# EAGLE design PrismTricoreVCO (EAGLE 9.6.2)
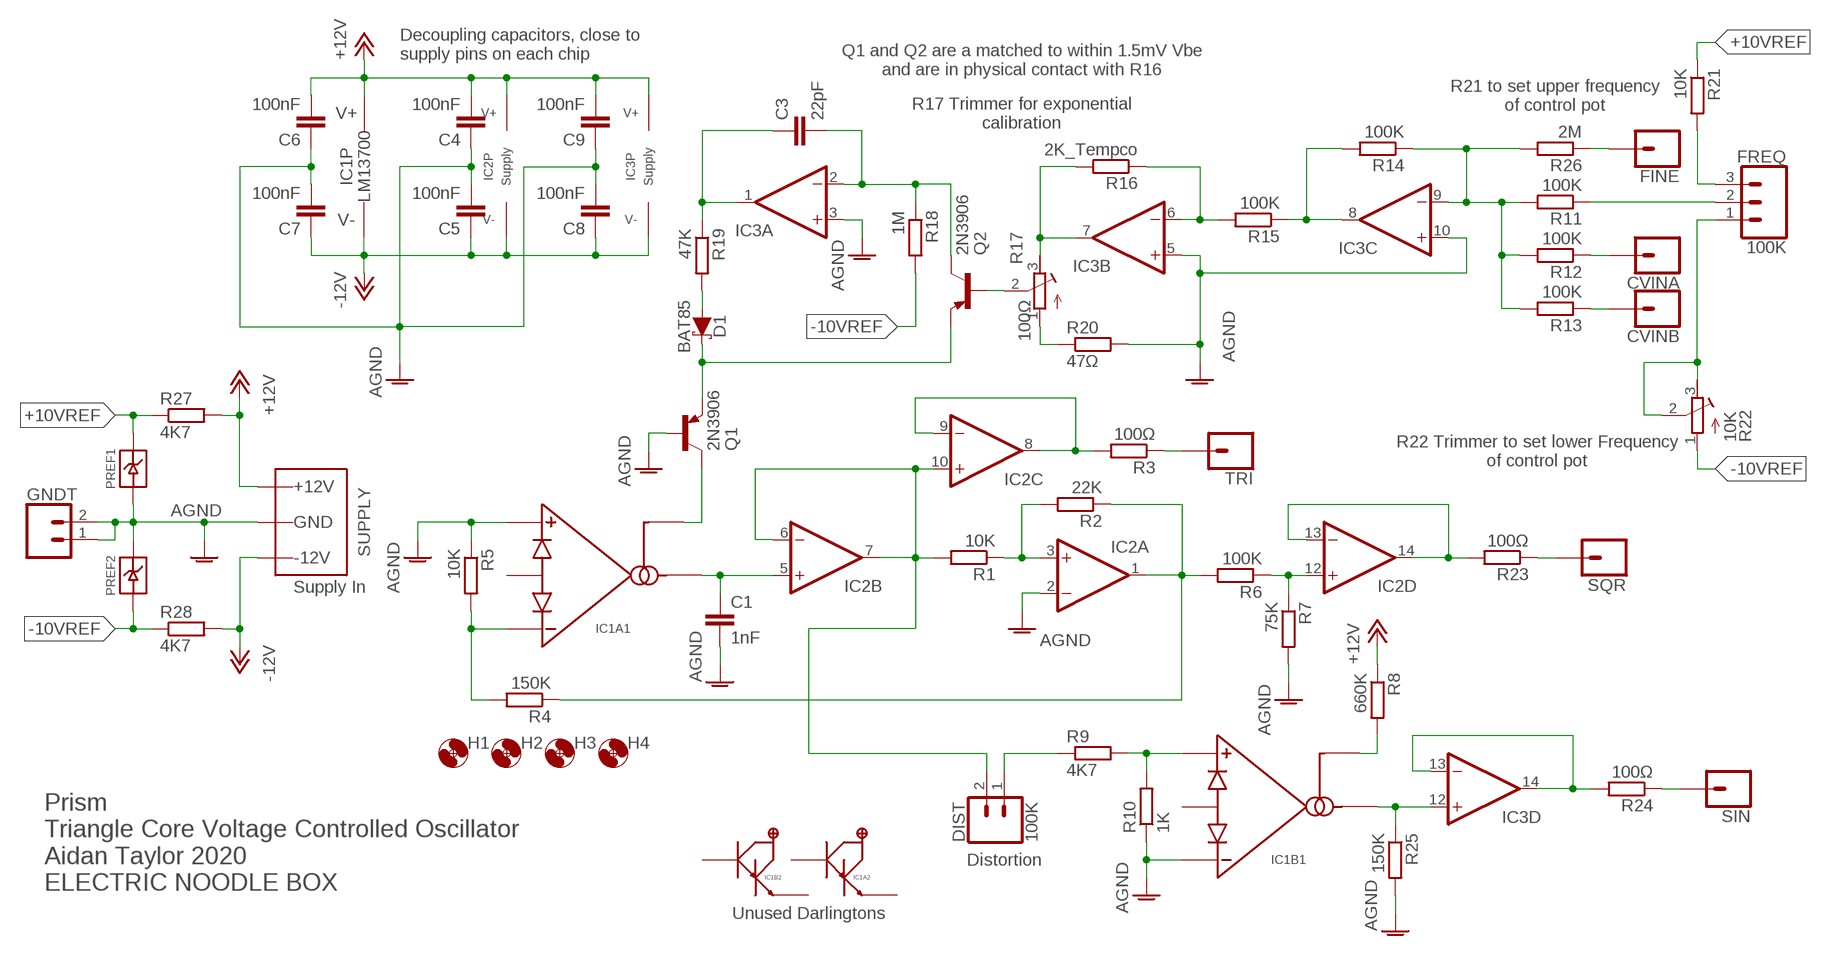
[diagram p0: schematic, sheet 1]

## Parts
C1  1nF  C-EU050-025X075  [C050-025X075]
C3  22pF  C-EU050-025X075  [C050-025X075]
C4  100nF  C-EU050-025X075  [C050-025X075]
C5  100nF  C-EU050-025X075  [C050-025X075]
C6  100nF  C-EU050-025X075  [C050-025X075]
C7  100nF  C-EU050-025X075  [C050-025X075]
C8  100nF  C-EU050-025X075  [C050-025X075]
C9  100nF  C-EU050-025X075  [C050-025X075]
CVINA  1XWIREPAD  [1X01]
CVINB  1XWIREPAD  [1X01]
D1  BAT85  SCHOTTKY_DO35  [DO35-7]
DIST  100K  2XWIREPAD  [1X02]
FINE  1XWIREPAD  [1X01]
FREQ  100K  3XWIREPAD  [1X03]
GNDT  2XWIREPAD  [1X02]
H1  MOUNT-HOLE3.2  [3,2]
H2  MOUNT-HOLE3.2  [3,2]
H3  MOUNT-HOLE3.2  [3,2]
H4  MOUNT-HOLE3.2  [3,2]
IC1  LM13700DIL  [DIL16]
IC2  TL0X4DIL  [DIL14]
IC3  TL0X4DIL  [DIL14]
PREF1  LM4040TH  [TO92]
PREF2  LM4040TH  [TO92]
Q1  2N3906  [TO92]
Q2  2N3906  [TO92]
R1  10K  R-EU_0207/10  [0207/10]
R2  22K  R-EU_0207/10  [0207/10]
R3  100Ω  R-EU_0207/10  [0207/10]
R4  150K  R-EU_0207/10  [0207/10]
R5  10K  R-EU_0207/10  [0207/10]
R6  100K  R-EU_0207/10  [0207/10]
R7  75K  R-EU_0207/10  [0207/10]
R8  660K  R-EU_0207/10  [0207/10]
R9  4K7  R-EU_0207/10  [0207/10]
R10  1K  R-EU_0207/10  [0207/10]
R11  100K  R-EU_0207/10  [0207/10]
R12  100K  R-EU_0207/10  [0207/10]
R13  100K  R-EU_0207/10  [0207/10]
R14  100K  R-EU_0207/10  [0207/10]
R15  100K  R-EU_0207/10  [0207/10]
R16  2K_Tempco  R-EU_0207/10  [0207/10]
R17  100Ω  R-TRIMM3296W  [RTRIM3296W]
R18  1M  R-EU_0207/10  [0207/10]
R19  47K  R-EU_0207/10  [0207/10]
R20  47Ω  R-EU_0207/10  [0207/10]
R21  10K  R-EU_0207/10  [0207/10]
R22  10K  R-TRIMM3296W  [RTRIM3296W]
R23  100Ω  R-EU_0207/10  [0207/10]
R24  100Ω  R-EU_0207/10  [0207/10]
R25  150K  R-EU_0207/10  [0207/10]
R26  2M  R-EU_0207/10  [0207/10]
R27  4K7  R-EU_0207/10  [0207/10]
R28  4K7  R-EU_0207/10  [0207/10]
SIN  1XWIREPAD  [1X01]
SQR  1XWIREPAD  [1X01]
TRI  1XWIREPAD  [1X01]
WP1  COMBO_SUPPLY_HEADER  [COMBINED_POWER]

## Nets
+10VREF: PREF1.2(CATHODE) R21.1 R27.1
+12V: C4.2 C6.2 C9.2 IC1.11(P:V+) IC2.4(P:V+) IC3.4(P:V+) R8.1 R27.2 WP1.V+1(V++) WP1.V+2(V++) WP1.V+3(V++)
-10VREF: PREF2.3(ANODE) R18.2 R22.1(A) R28.1
-12V: C5.1 C7.1 C8.1 IC1.6(P:V-) IC2.11(P:V-) IC3.11(P:V-) R28.2 WP1.V-1(V--) WP1.V-2(V--) WP1.V-3(V--)
AGND: C1.2 C4.1 C5.2 C6.1 C7.2 C8.2 C9.1 GNDT.1 GNDT.2 IC1.3(A1:AMP+) IC1.13(B1:AMP-) IC2.2(A:-IN) IC3.3(A:+IN) IC3.5(B:+IN) IC3.10(C:+IN) PREF1.3(ANODE) PREF2.2(CATHODE) Q1.2(B) R5.1 R7.2 R10.1 R20.2 R25.2 WP1.GND1(AGND) WP1.GND2(AGND) WP1.GND3(AGND) WP1.GND4(AGND) WP1.GND5(AGND) WP1.GND6(AGND) WP1.GND7(AGND) WP1.GND8(AGND)
N$1: DIST.2 IC2.6(B:-IN) IC2.7(B:OUT) IC2.10(C:+IN) R1.2
N$3: IC2.3(A:+IN) R1.1 R2.2
N$4: C1.1 IC1.5(A1:AMPOUT) IC2.5(B:+IN)
N$5: IC2.1(A:OUT) R2.1 R4.1 R6.2
N$6: IC2.8(C:OUT) IC2.9(C:-IN) R3.2
N$7: IC1.4(A1:AMP-) R4.2 R5.2
N$8: IC1.14(B1:AMP+) R9.2 R10.2
N$9: IC2.12(D:+IN) R6.1 R7.1
N$10: IC1.12(B1:AMPOUT) IC3.12(D:+IN) R25.1
N$11: IC1.16(B1:AMPBIAS) R8.2
N$12: IC1.1(A1:AMPBIAS) Q1.1(C)
N$13: DIST.1 R9.1
N$14: IC3.7(B:OUT) R16.2 R17.3(E)
N$15: IC3.6(B:-IN) R15.2 R16.1
N$16: IC3.8(C:OUT) R14.2 R15.1
N$17: Q2.2(B) R17.2(S)
N$18: C3.2 IC3.2(A:-IN) Q2.1(C) R18.1
N$19: R17.1(A) R20.1
N$20: C3.1 IC3.1(A:OUT) R19.1
N$21: D1.C Q1.3(E) Q2.3(E)
N$22: D1.A R19.2
N$23: IC3.9(C:-IN) R11.2 R12.2 R13.2 R14.1 R26.2
N$24: FREQ.2 R11.1
N$25: FREQ.1 R22.2(S) R22.3(E)
N$26: FREQ.3 R21.2
N$27: CVINA.1 R12.1
N$28: CVINB.1 R13.1
N$29: R3.1 TRI.1
N$30: R23.1 SQR.1
N$31: R24.1 SIN.1
N$32: FINE.1 R26.1
SINE_OUT: IC3.13(D:-IN) IC3.14(D:OUT) R24.2
SQUARE_OUT: IC2.13(D:-IN) IC2.14(D:OUT) R23.2
Unconnected: IC1.2(A1:DIODES) IC1.7(A2:BUFF_IN) IC1.8(A2:BUFF_OUT) IC1.9(B2:BUFF_OUT) IC1.10(B2:BUFF_IN) IC1.15(B1:DIODES)

## Notes on the sheet
- Decoupling capacitors, close to 
  supply pins on each chip
- Q1 and Q2 are a matched to within 1.5mV Vbe
  and are in physical contact with R16
- R21 to set upper frequency
  of control pot
- R17 Trimmer for exponential
  calibration
- R22 Trimmer to set lower Frequency
  of control pot
- Supply In
- Prism
  Triangle Core Voltage Controlled Oscillator
  Aidan Taylor 2020
  ELECTRIC NOODLE BOX
- Distortion
- Unused Darlingtons

## Library data of the parts
C1 C3-C9 = rcl:C-EU: CAPACITOR, European symbol; SPICEPREFIX: C
CVINA CVINB FINE SIN SQR TRI = ElectricNoodleBox:1XWIREPAD
D1 = ElectricNoodleBox:SCHOTTKY_DO35
DIST GNDT = ElectricNoodleBox:2XWIREPAD
FREQ = ElectricNoodleBox:3XWIREPAD
H1-H4 = holes:MOUNT-HOLE: MOUNTING HOLE with drill center marker
IC1 = ElectricNoodleBox:LM13700
IC2 IC3 = ElectricNoodleBox:TL0X4
PREF1 PREF2 = ElectricNoodleBox:LM4040
Q1 Q2 = transistor-pnp:2N3906: PNP Transistor
R1-R16 R18-R21 R23-R28 = rcl:R-EU_: RESISTOR, European symbol; SPICEPREFIX: R
R17 R22 = rcl:R-TRIMM: Trimm resistor; SPICEMODEL: X; SPICEPREFIXL: POT
WP1 = ElectricNoodleBox:COMBO_SUPPLY_HEADER

## Board
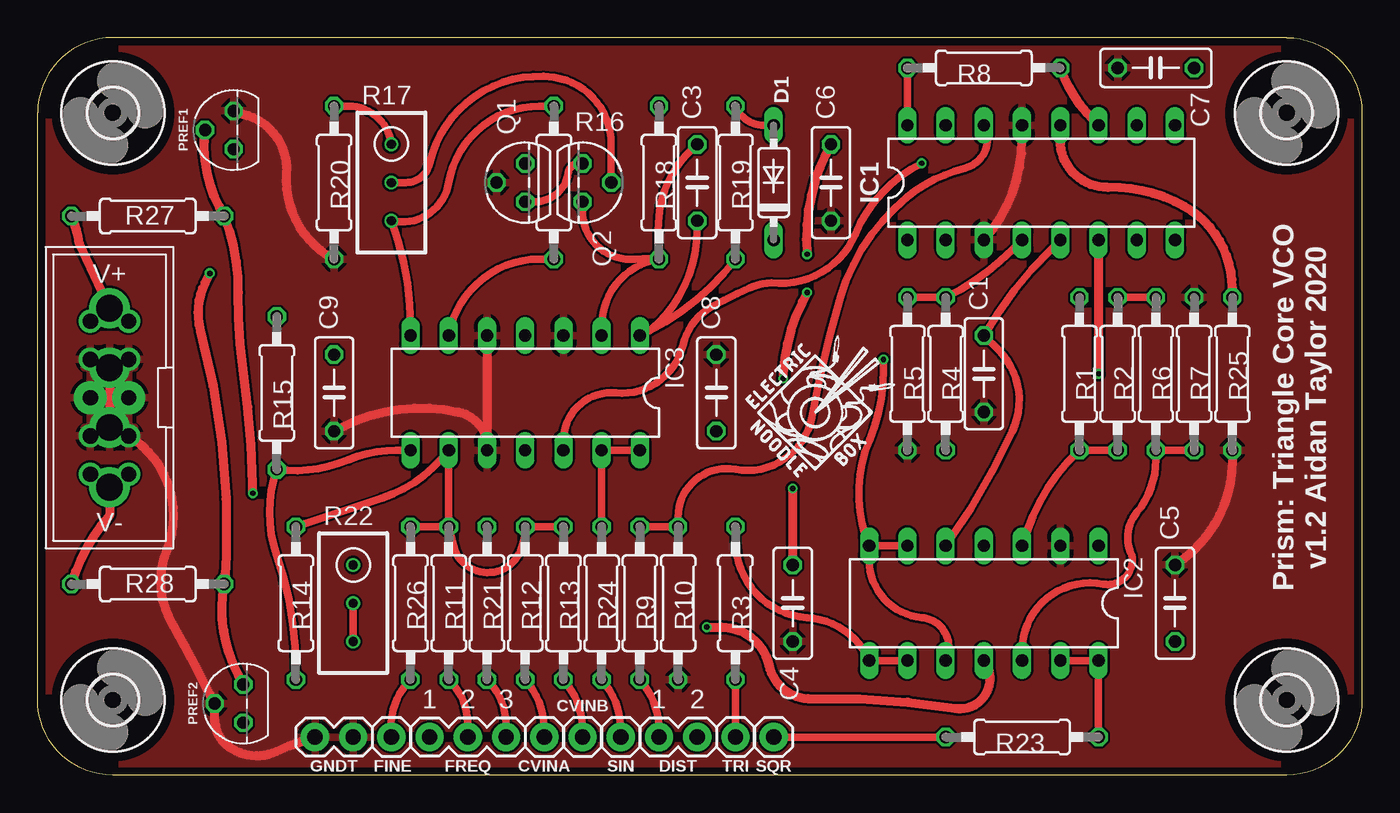
[diagram p1: board, top side]
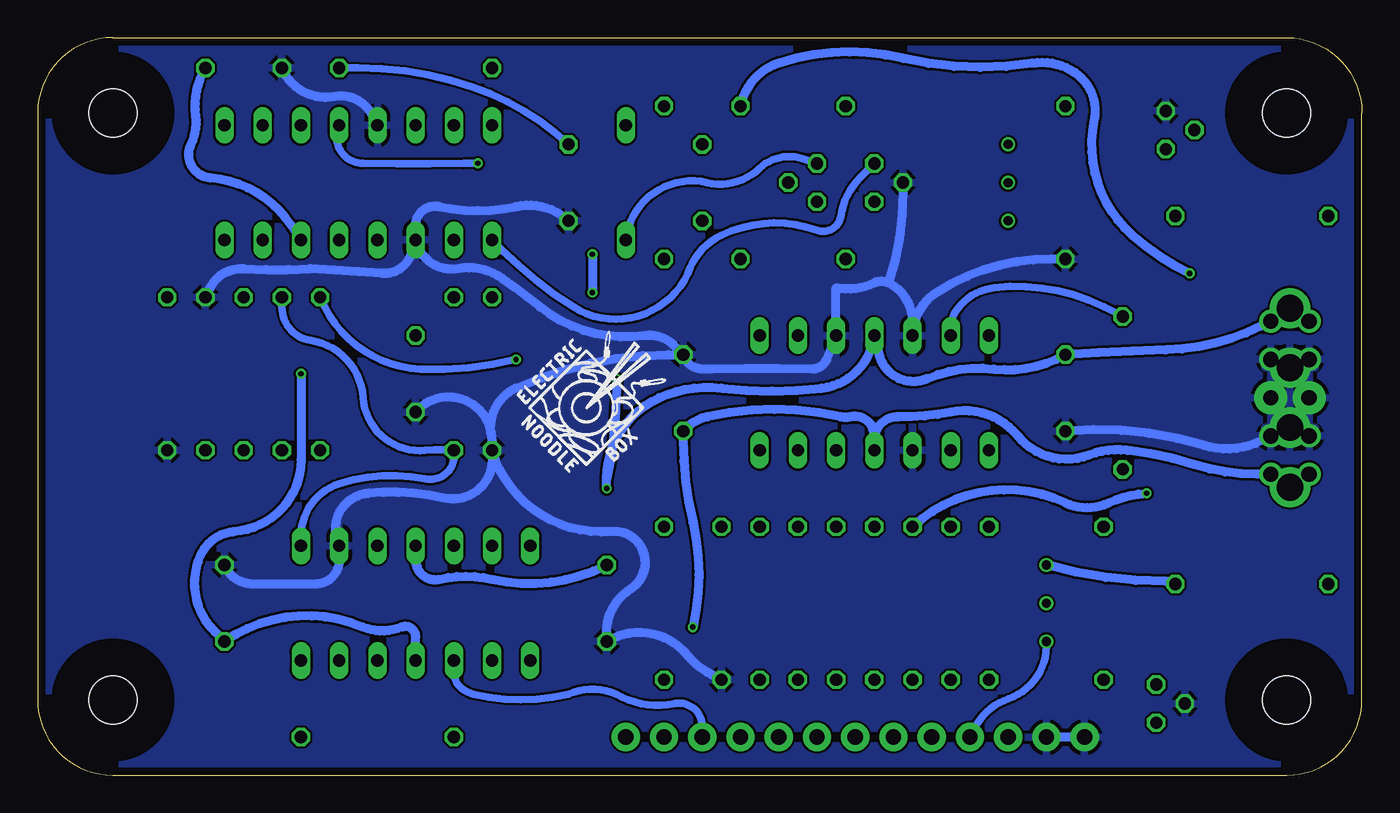
[diagram p2: board, bottom side, seen from below]

Size 88 x 49 mm. Coordinates in mm from the lower left corner, seen from the top.
Outline: 83,49 5,49 arc90 0,44 0,5 arc90 5,0 83,0 arc90 88,5 88,44 arc90 83,49
Copper layers (1*16): Top 0.035mm / dielectric 1.6mm / Bottom 0.035mm
Design rules "Elecrow_2-layer_PCB_eagle_rule": minimum track width 6mil, minimum drill 12mil, track to track 6mil, track to pad 6mil, pad to pad 6mil, via to via 8mil, smd to smd 0mil, copper to edge 20mil, drill to drill 10mil, minimum pad ring 6mil, minimum via ring 6mil, stop-mask expansion 0mil, vias tented up to drill 100mil, thermal gap 10mil

### Footprints (pad centres in the part's own frame; a part is rotated, then mirrored left to right if it is on the bottom)
C050-025X075 = drill 0.813 octagon: 1 -2.54,0; 2 2.54,0
1X01 = drill 1.016 pad 1.88: 1 0,0
DO35-7 = drill 0.813 long: A 3.81,0; C -3.81,0
1X02 = drill 1.016 pad 1.88: 1 0,0; 2 2.54,0
1X03 = drill 1.016 pad 1.88: 1 0,0; 2 2.54,0; 3 5.08,0
3,2 = hole 3.2: 0,0
DIL16 = drill 0.813 long: 1 -8.89,-3.81; 2 -6.35,-3.81; 3 -3.81,-3.81; 4 -1.27,-3.81; 5 1.27,-3.81; 6 3.81,-3.81; 7 6.35,-3.81; 8 8.89,-3.81; 9 8.89,3.81; 10 6.35,3.81; 11 3.81,3.81; 12 1.27,3.81; 13 -1.27,3.81; 14 -3.81,3.81; 15 -6.35,3.81; 16 -8.89,3.81
DIL14 = drill 0.813 long: 1 -7.62,-3.81; 2 -5.08,-3.81; 3 -2.54,-3.81; 4 0,-3.81; 5 2.54,-3.81; 6 5.08,-3.81; 7 7.62,-3.81; 8 7.62,3.81; 9 5.08,3.81; 10 2.54,3.81; 11 0,3.81; 12 -2.54,3.81; 13 -5.08,3.81; 14 -7.62,3.81
TO92 = drill 0.813 octagon: 1 -1.27,0; 2 0,1.905; 3 1.27,0
TO92' = drill 0.813 octagon: 1 1.27,0; 2 0,1.905; 3 -1.27,0
0207/10 = drill 0.813 octagon: 1 -5.08,0; 2 5.08,0
RTRIM3296W = drill 0.61: 1 0,-2.54; 2 0,0; 3 0,2.54
COMBINED_POWER = drill 1.78: GND1 -1.98,0; GND2 1.98,0; V+1 -5.94,0; V-1 5.94,0 | drill 1.016: GND3 -2.54,1.27; GND5 2.54,1.27; GND6 -2.54,-1.27; GND8 2.54,-1.27; V+2 -5.08,1.27; V+3 -5.08,-1.27; V-2 5.08,1.27; V-3 5.08,-1.27 | drill 1.016 pad 2.184: GND4 0,1.27; GND7 0,-1.27

### Placement (x,y rotation side)
C1  62.88,26.67 270 top
C3  43.83,39.37 90 top
C4  50.18,11.43 90 top
C5  75.58,11.43 90 top
C6  52.72,39.37 90 top
C7  74.31,46.99 180 top
C8  45.1,25.4 90 top
C9  19.7,25.4 90 top
CVINA  33.67,2.54 0 top
CVINB  36.21,2.54 0 top
D1  48.91,39.37 90 top
DIST  41.29,2.54 0 top
FINE  23.51,2.54 0 top
FREQ  26.05,2.54 0 top
GNDT  18.43,2.54 0 top
H1  83,44 0 top
H2  83,5 0 top
H3  5,5 0 top
H4  5,44 0 top
IC1  66.69,39.37 0 top
IC2  62.88,11.43 180 top
IC3  32.4,25.4 180 top
PREF1  13.03,42.86 90 top
PREF2  13.67,4.76 90 top
Q1  2N3906  [TO92']  32.4,39.37 90 top
Q2  2N3906  [TO92']  36.21,39.37 270 top
R1  69.23,26.67 90 top
R2  71.77,26.67 270 top
R3  46.37,11.43 90 top
R4  60.34,26.67 90 top
R5  57.8,26.67 90 top
R6  74.31,26.67 90 top
R7  76.85,26.67 90 top
R8  62.88,46.99 180 top
R9  40.02,11.43 90 top
R10  42.56,11.43 90 top
R11  27.32,11.43 90 top
R12  32.4,11.43 90 top
R13  34.94,11.43 90 top
R14  17.16,11.43 270 top
R15  15.89,25.4 90 top
R16  34.3,39.37 90 top
R17  23.51,39.37 180 top
R18  41.29,39.37 90 top
R19  46.37,39.37 90 top
R20  19.7,39.37 270 top
R21  29.86,11.43 270 top
R22  20.97,11.43 180 top
R23  65.42,2.54 0 top
R24  37.48,11.43 90 top
R25  79.39,26.67 270 top
R26  24.78,11.43 90 top
R27  7.32,37.15 180 top
R28  7.32,12.7 180 top
SIN  38.75,2.54 0 top
SQR  48.91,2.54 0 top
TRI  46.37,2.54 0 top
U$1  [LOGO10X10]  47,19.5 0 top
U$2  [LOGO10X10]  56.21,19.82 0 bottom
WP1  4.78,25.08 270 top

### Tracks (layer width: path | path; a pad name or v marks a point on that pad's centre or on a via)
+10VREF  (via drill 0.35)
  Top 0.61: v14.3,18.73 14.29,19.37 arc7 13.65,26.99 arc-9 13.34,32.07 arc23 R27.1 12.06,37.78 arc-34 PREF1.2
  Bottom 0.61: R21.1 arc68 19.7,18.1 arc-50 16.84,18.1 arc22 v14.3,18.73
+12V  (via drill 0.35)
  Top 0.61: C4.2 v50.18,19.05 | C6.2 52.4,41.27 arc32 v51.13,34.61 | v51.13,32.07 50.81,31.43 arc23 49.55,26.67 arc7 v49.55,26.35 | IC1.11 70.18,43.5 arc-25 R8.1 | WP1.V+1 WP1.V+2 | WP1.V+1 WP1.V+3 | WP1.V+1 2.77,35.34 arc17 R27.2
  Bottom 0.508: R8.1 66.69,46.99 arc19 59.07,45.72 arc24 C6.2
  Bottom 0.61: IC2.4 62.88,14.29 arc-103 61.29,13.02 arc25 57.8,13.02 arc-40 C4.2 | v50.18,19.05 50.18,19.68 | 50.18,19.68 arc66 46.69,25.08 arc31 42.56,25.72 arc-13 35.89,25.72 arc-77 IC3.4 32.08,27.94 arc-99 28.91,26.35 arc29 24.46,26.99 arc-36 C9.2 arc2 13.03,28.26 arc-25 6.68,29.84 WP1.V+2 | v51.13,34.61 v51.13,32.07 | v49.55,26.35 49.55,25.72 arc12 50.18,19.68
-10VREF  (via drill 0.35)
  Top 0.61: v11.45,33.34 11.13,32.7 arc42 10.81,29.53 arc-17 12.54,14.57 arc-5 R28.1 arc38 13.34,6.67 PREF2.3
  Bottom 0.61: R18.2 arc61 38.75,47.31 arc32 30.5,47.62 arc-23 21.92,47.31 arc44 19.07,46.67 arc67 17.8,43.5 arc-61 15.26,35.88 arc-15 v11.45,33.34 | R28.1 13.01,12.87 arc16 R22.1
-12V  (via drill 0.35)
  Top 0.61: v44.47,9.84 45.42,9.84 arc-77 48.59,7.3 arc79 51.45,5.08 arc-11 60.98,4.45 arc136 IC2.11 | IC1.6 v70.5,26.67 | WP1.V-1 WP1.V-3 | WP1.V-1 4.78,17.27 arc24 R28.2 | WP1.V-1 5.64,20 WP1.V-2
  Bottom 0.61: IC2.11 62.88,9.21 arc-113 63.83,9.84 arc45 66.37,9.84 arc-57 C5.1 76.22,9.53 arc69 77.17,14.61 arc61 74.94,16.19 arc-86 70.5,20.95 v70.5,26.67 | IC3.11 32.4,21.91 | 32.4,21.91 32.4,22.54 arc-103 33.99,23.81 arc25 34.62,23.81 arc-25 43.51,23.81 arc-37 C8.1 45.1,22.23 arc-13 44.47,16.83 arc27 v44.47,9.84 | IC1.6 71.14,36.51 arc-52 76.53,39.69 arc111 77.8,41.91 arc-33 77.48,43.81 arc37 C7.1 | WP1.V-2 7,20 arc17 11.13,20.64 arc-11 15.57,21.59 arc-28 18.11,21.27 arc72 22.88,22.54 arc-62 27.32,24.13 arc13 30.81,23.81 arc-103 32.4,21.91
AGND
  Top 0.61: IC1.3 arc42 65.42,42.23 IC1.13 | IC3.5 29.86,22.23 | 29.86,22.23 IC3.10 | 29.86,22.23 arc65 27.95,24.13 arc39 20.34,23.18 C9.1 | R25.2 79.39,20.95 arc-57 C5.2 | PREF1.3 13.98,43.81 arc-76 16.52,40.01 arc66 R20.2 | WP1.GND2 WP1.GND5 arc-81 8.59,14.92 arc52 8.9,10.16 arc-3 11.45,5.4 PREF2.2 11.75,3.81 arc55 12.7,1.91 arc61 15.88,1.59 arc-8 GNDT.1 | WP1.GND2 WP1.GND8 | WP1.GND7 WP1.GND2 | WP1.GND2 WP1.GND4 | WP1.GND6 WP1.GND1 | WP1.GND1 WP1.GND3 | WP1.GND1 WP1.GND2
  Bottom 0.61: C5.2 arc-67 73.67,12.7 69.55,12.7 arc-90 67.96,14.29 IC2.2 arc112 66.06,18.73 arc18 60.98,18.41 arc-103 57.8,20.95 R5.1 | R5.1 57.8,22.23 | 57.8,22.23 arc-139 C1.2 | R5.1 arc-78 49.86,16.19 arc153 48.59,12.38 arc-58 50.18,9.53 C4.1 arc81 44.78,7.94 arc-24 43.2,6.67 R10.1 | IC1.3 62.88,36.51 arc103 61.29,37.78 arc-25 56.21,37.78 arc56 C6.1 | 57.8,22.23 arc82 56.21,25.72 arc25 46.05,27.94 C8.2 | 31.45,32.7 arc64 29.86,30.16 IC3.5 arc57 28.27,32.07 arc33 20.65,34.29 R20.2 | IC1.3 arc-87 60.02,33.66 arc45 57.16,33.02 arc4 54.62,31.11 arc-47 47.64,29.21 arc53 45.73,28.57 C8.2 | Q1.2 30.5,38.73 arc18 31.45,32.7 | 31.45,32.7 arc-52 32.4,32.7 arc38 34.94,32.38 IC3.3 35.58,27.62 arc69 36.53,26.99 arc-2 43.2,26.99 arc2 43.83,26.99 arc72 C8.2 | IC1.13 65.74,43.81 arc-74 68.28,45.09 arc78 C7.2 | IC1.3 63.2,34.61 arc76 65.1,33.34 arc-1 69.86,33.66 arc8 74.31,33.66 arc-67 76.53,32.38 R7.2 | WP1.GND5 6.68,22.23 arc44 10.49,21.91 arc-22 C9.1 | GNDT.1 GNDT.2
  pour Top: 34.94,32.07 33.67,32.07 arc-90 28.59,37.15 28.59,41.59 arc-90 33.67,46.67 34.94,46.67 arc-90 40.02,41.59 40.02,37.15 arc-90
  pour Bottom: 40.02,41.59 40.02,37.15 arc-90 34.94,32.07 33.67,32.07 arc-90 28.59,37.15 28.59,41.59 arc-90 33.67,46.67 34.94,46.67 arc-90
  pour Top: 0,0 88,0 88,49 0,49
  pour Bottom: 0,0 88,0 88,49 87,49 1,49 0,49
N$1  (via drill 0.35)
  Top 0.508: IC2.7 55.26,14.29 arc85 58.75,10.48 arc-112 IC2.10 | IC2.6 IC2.7 | v56.21,27.62 56.21,26.99 arc-23 55.26,22.23 arc45 IC2.7
  Bottom 0.508: IC2.10 arc-94 59.07,5.4 arc-27 52.72,5.4 arc44 49.55,5.4 arc-42 45.72,4.76 arc103 43.81,3.17 DIST.2 | R1.2 68.91,31.11 arc-61 62.56,26.99 arc-17 v56.21,27.62
N$3
  Top 0.508: IC2.3 65.74,16.19 arc-29 R1.1 R2.2
N$4
  Top 0.508: IC1.5 67.33,34.92 arc14 C1.1 63.83,28.26 arc-70 64.78,22.86 arc-11 IC2.5
N$5
  Top 0.508: R2.1 R6.2
  Bottom 0.508: IC2.1 70.5,15.88 arc72 67.96,19.37 arc30 62.24,19.68 arc-113 R4.1 arc-11 62.24,21.59 arc92 66.37,25.08 arc-77 69.86,28.89 arc81 71.77,31.11 R2.1
N$6
  Top 0.508: IC2.9 IC2.8 arc62 51.13,10.48 arc-86 46.37,15.56 R3.2
N$7
  Top 0.508: R5.2 R4.2 arc19 64.78,34.92 IC1.4
N$8
  Top 0.508: R9.2 R10.2 42.56,17.14 arc-100 46.37,20.32 arc90 51.45,23.81 arc-6 53.35,31.75 arc-35 57.8,38.42 arc-25 61.61,40.32 arc104 IC1.14
N$9
  Top 0.508: IC2.12 65.42,8.26 arc-101 70.82,12.7 arc112 72.72,14.61 arc-67 73.04,17.46 arc40 74.31,20.95 R6.1 R7.1
N$10  (via drill 0.35)
  Top 0.508: IC3.12 34.94,22.23 arc-95 38.43,25.4 arc82 42.88,28.57 arc-47 44.78,31.11 arc-6 47.32,32.38 arc-22 48.77,32.7 arc74 54.34,35.95 arc-41 58.75,40.64 arc221 v58.74,40.65
  Top 0.61: R25.1 79.39,32.38 arc61 76.22,37.78 arc30 71.14,39.05 arc-92 67.96,42.23 arc2 IC1.12
  Bottom 0.508: v58.74,40.65 59.7,40.64 arc1 66.37,40.64 arc115 IC1.12
N$11
  Top 0.508: R8.2 IC1.16
N$12
  Bottom 0.508: Q1.1 33.35,39.69 arc-37 34.62,37.15 arc102 36.21,36.2 arc-46 42.56,35.88 arc-46 44.78,33.34 arc97 52.4,31.11 arc13 57.16,34.92 IC1.1
N$13
  Top 0.508: DIST.1 41.27,3.17 arc40 R9.1
N$14
  Top 0.508: IC3.7 24.78,29.84 arc21 R17.3 arc93 27.32,39.37 arc-80 33.35,44.45 R16.2
N$15
  Top 0.508: R16.1 33.35,34.29 arc80 IC3.6
  Bottom 0.508: R15.2 17.16,31.11 arc-33 24.46,32.38 arc-50 27,30.8 arc-43 IC3.6
N$16
  Top 0.508: R14.2 17.16,6.99 arc19 15.89,14.61 arc-38 R15.1 arc30 20.65,20.95 arc-23 23.83,21.59 IC3.8
N$17
  Top 0.508: R17.2 24.46,39.37 arc77 26.05,40.64 arc-85 34.3,46.35 arc-83 38.12,41.91 arc2 Q2.2
N$18
  Top 0.508: Q2.1 36.21,37.47 arc95 39.7,34.29 arc-11 R18.1 | IC3.2 37.48,29.84 arc-81 R18.1 | C3.2 43.2,41.27 arc40 41.29,37.15 arc9 R18.1
N$19
  Top 0.508: R20.1 20.65,44.45 arc-83 R17.1
N$20
  Top 0.508: IC3.1 40.66,29.53 | 40.66,29.53 arc26 R19.1 | C3.1 43.83,36.2 arc-51 40.66,29.53
N$21
  Top 0.508: Q1.3 33.03,38.1 arc81 35.26,40.01 arc-95 Q2.3
  Bottom 0.508: Q2.3 37.16,40.96 arc-62 40.02,40.32 arc56 43.51,39.37 arc-96 D1.C
N$22
  Top 0.508: D1.A 48.27,43.18 arc-67 R19.2
N$23
  Top 0.508: R11.2 IC3.9 arc-34 22.88,18.41 R14.1 | R13.2 R12.2 arc-22 32.08,14.92 arc-144 27.64,15.24 R11.2 | R26.2 R11.2
N$24
  Top 0.508: FREQ.2 28.57,3.49 arc46 R11.1
N$25
  Top 0.508: R22.3 R22.2
  Bottom 0.508: FREQ.1 25.72,3.17 arc44 23.5,5.08 arc-75 R22.3
N$26
  Top 0.508: FREQ.3 31.11,3.49 arc46 R21.2
N$27
  Top 0.508: CVINA.1 33.66,3.17 arc40 R12.1
N$28
  Top 0.508: CVINB.1 36.2,3.17 arc40 R13.1
N$29
  Top 0.508: TRI.1 R3.1
N$30
  Top 0.508: SQR.1 R23.1
N$31
  Top 0.508: SIN.1 38.73,3.17 arc40 R24.1
N$32
  Top 0.508: FINE.1 23.5,3.17 arc-47 R26.1
SINE_OUT
  Top 0.508: R24.2 IC3.13 IC3.14
SQUARE_OUT
  Top 0.508: IC2.13 IC2.14 R23.2

### Text on the board
tPlace: Prism: Triangle Core VCO / v1.2 Aidan Taylor 2020 | 1 | 2 | 3 | 1 | 2